# Altium schematic sheet main_connector.SchDoc: SDL - Main
size Letter; Author: Ye-Sheng Kuo; Revision: 1; SheetNumber: 6; SheetTotal: 8
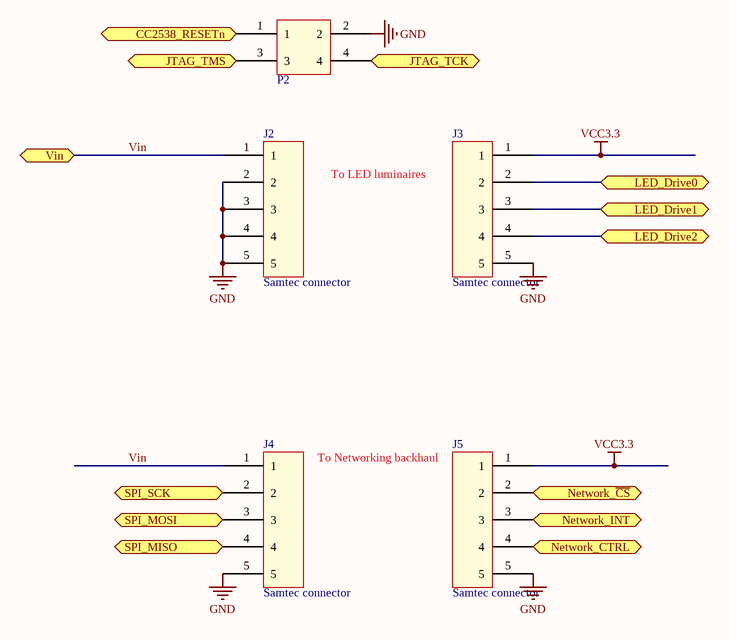
[diagram p0: main_connector.SchDoc]

## Parts
J2  Samtec connector  [SFM-105-02-L-S]
J3  Samtec connector  [SFM-105-02-L-S]
J4  Samtec connector  [SFM-105-02-L-S]
J5  Samtec connector  [SFM-105-02-L-S]
P2  2 x 2 header SMD  [2x2 header SMD]  (value not drawn)

## Ports
CC2538_RESETn, JTAG_TCK, JTAG_TMS, LED_Drive0, LED_Drive1, LED_Drive2, Network_CTRL, Network_INT, Network_~{CS}, SPI_MISO, SPI_MOSI, SPI_SCK, Vin

## Nets
GND: J2.2 J2.3 J2.4 J2.5 J3.5 J4.5 J5.5 P2.2
VCC3.3: J3.1 J5.1
CC2538_RESETn: P2.1 ; port CC2538_RESETn
JTAG_TCK: P2.4 ; port JTAG_TCK
JTAG_TMS: P2.3 ; port JTAG_TMS
LED_Drive0: J3.2 ; port LED_Drive0
LED_Drive1: J3.3 ; port LED_Drive1
LED_Drive2: J3.4 ; port LED_Drive2
Network_~{CS}: J5.2 ; port Network_~{CS}
Network_CTRL: J5.4 ; port Network_CTRL
Network_INT: J5.3 ; port Network_INT
SPI_MISO: J4.4 ; port SPI_MISO
SPI_MOSI: J4.3 ; port SPI_MOSI
SPI_SCK: J4.2 ; port SPI_SCK
Vin: J2.1 J4.1 ; port Vin

## Notes on the sheet
- To LED luminaires
- To Networking backhaul
- Title
- Date:
- Author:
- Revision:
- Sheet
- of
- University of Michigan
- File:

## Library data of the parts
J2-J5 = Samtec conntector: Samtec connector, 1.27 mm, single row, 5 pos SMD; Supplier 1: Samtec
P2 = 2 x 2 header SMD: 2x2 100 mil header SMD; Supplier 1: Digi-Key; Supplier Part Number 1: 609-4463-6-ND